# Altium schematic sheet fpga1.SchDoc: FPGA First Part
size A2; Organization: Berne University of Applied Science; Address1: School of Engineering and; Address2: Information Technology; Address3: Quellgasse 21; Address4: CH-2501 Biel; Revision: 1.0; SheetNumber: 3; SheetTotal: 19; ApprovedBy: zem1; Author: zac1; PageSetup: Record=PageOptions|CenterHorizontal=True|CenterVertical=True|PrintScale=0.71|XCorrection=1.00|YCorrection=1.00|PrintKind=0|BorderSize=5000000|LeftOffset=0|BottomOffset=0|Orientation=2|PaperLength=1000|PaperWidth=1000|Scale=100|PaperSource=15|PrintQuality=4000|MediaType=1|DitherType=0|PaperKind=A3|PrintScaleMode=1
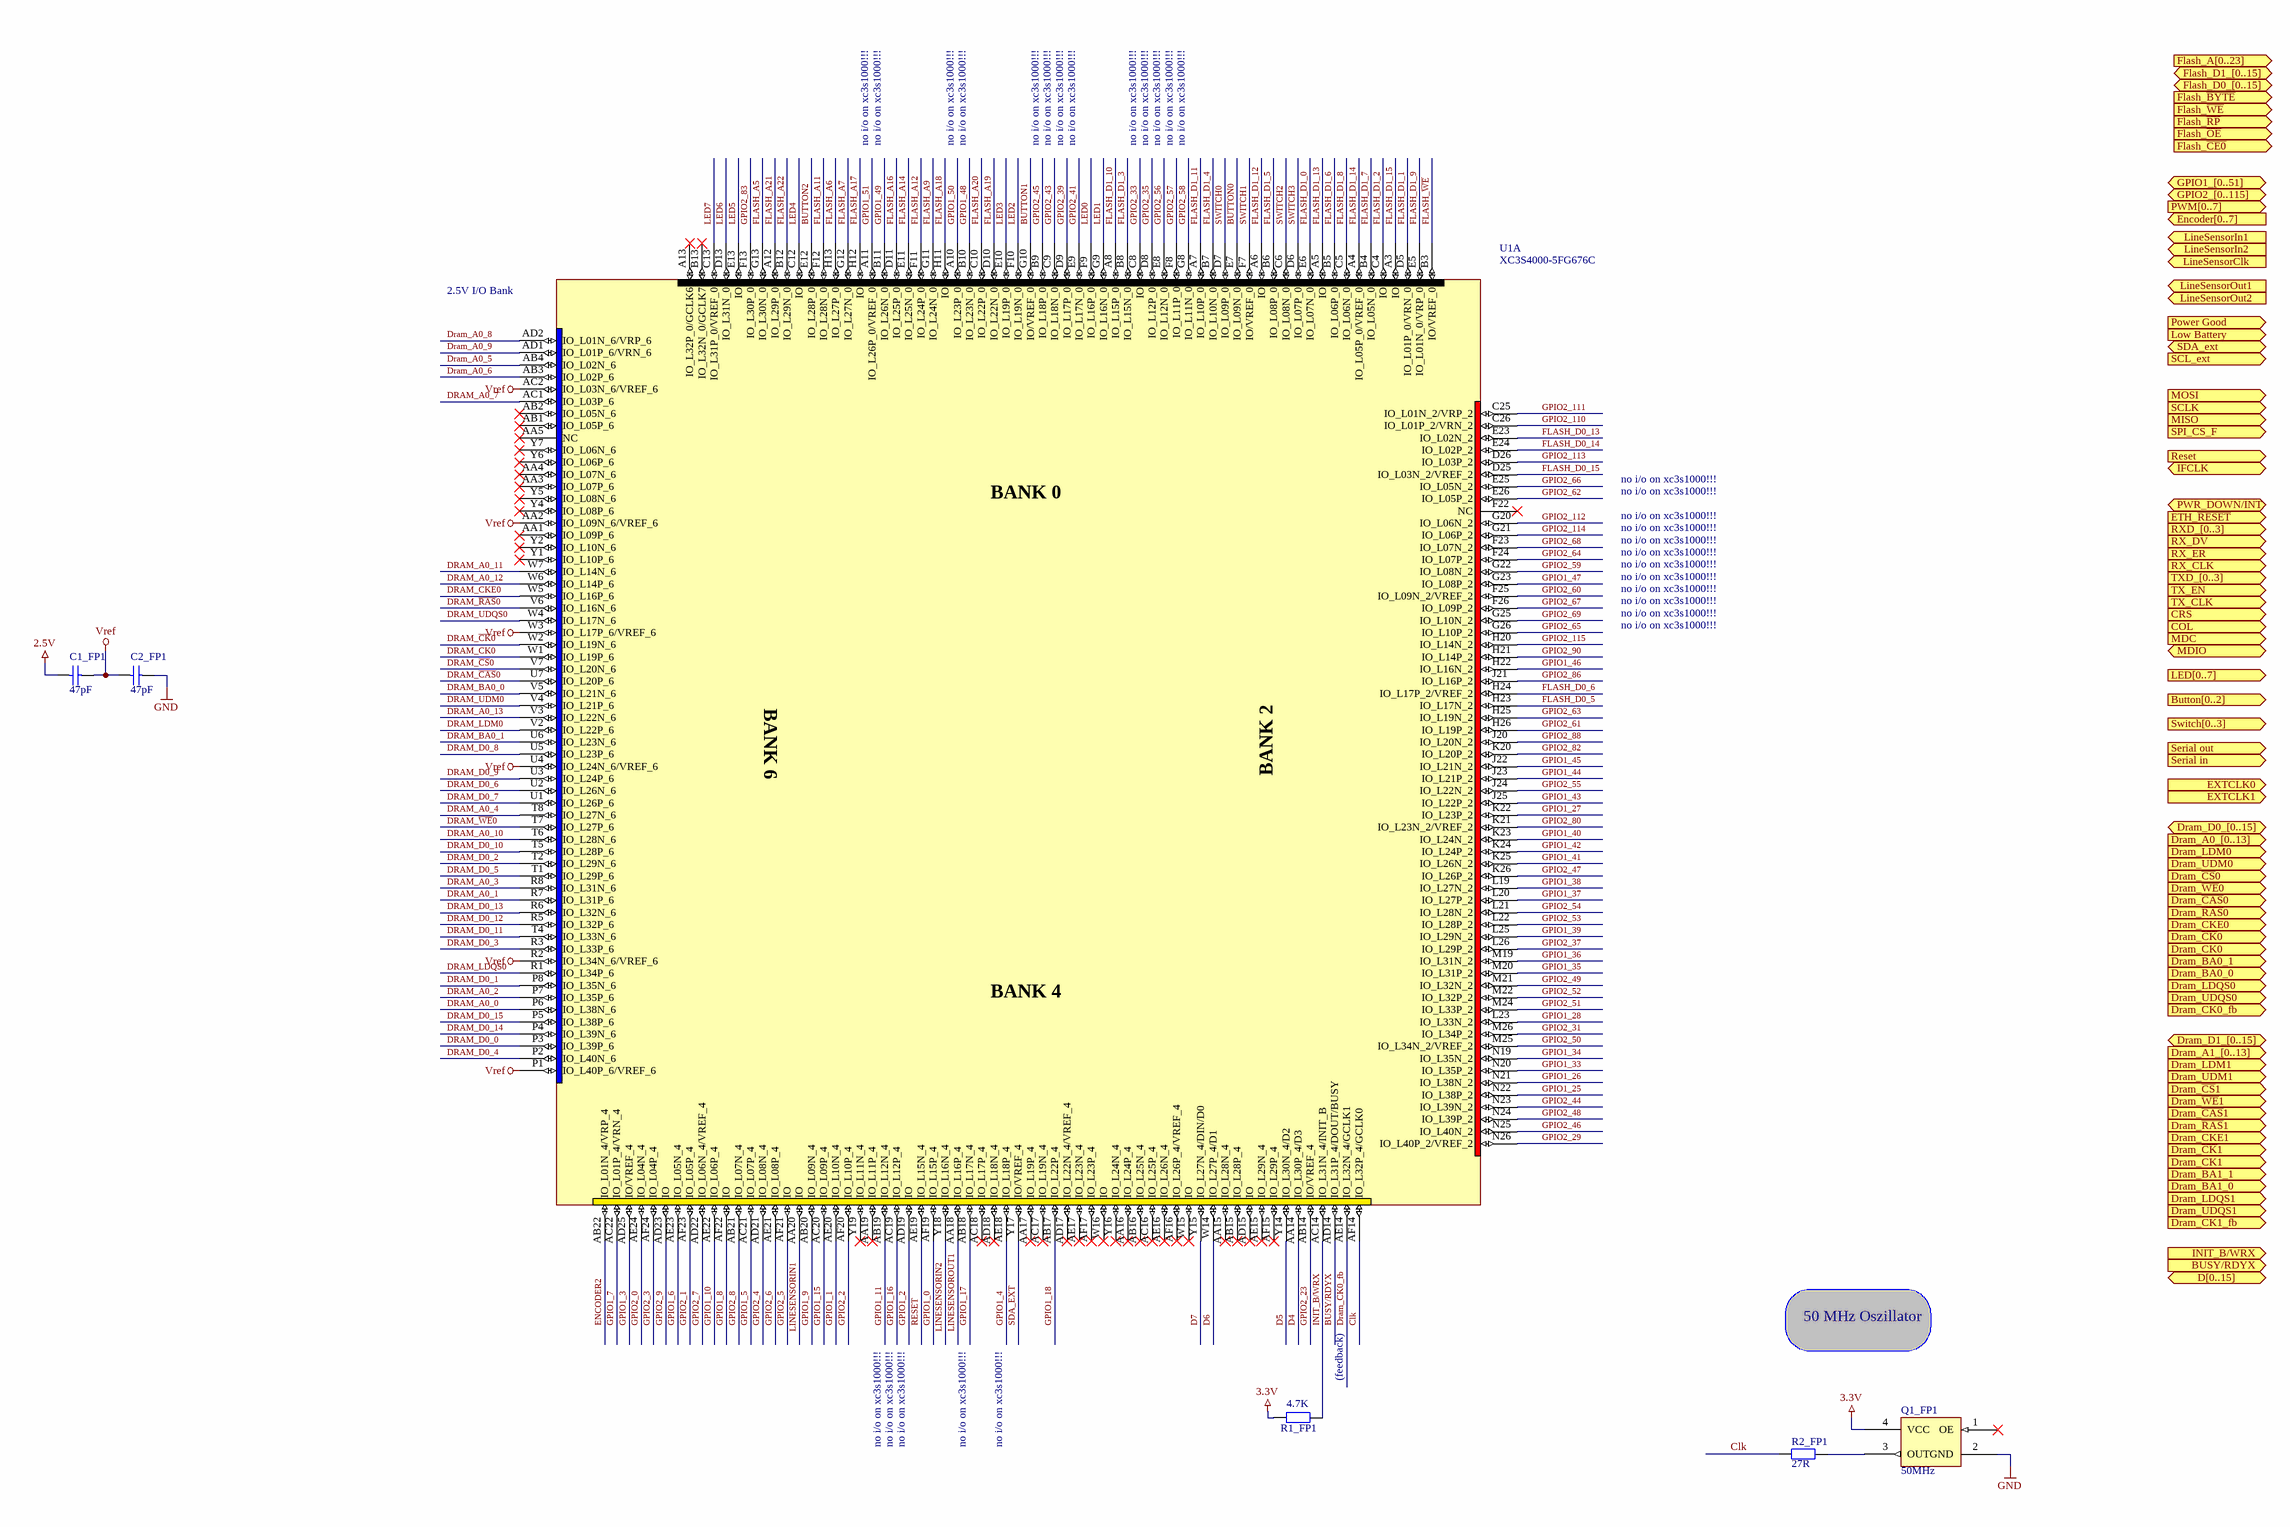
[diagram p0: fpga1.SchDoc]

## Parts
C1_FP1  value 47pF  [0402]  (hidden comment: Cap)
C2_FP1  value 47pF  [0402]  (hidden comment: Cap)
Q1_FP1  50MHz  [SMD-VX3E]
R1_FP1  value 4.7K  [0402]  (hidden comment: Res2)
R2_FP1  value 27R  [0402]  (hidden comment: Res2)
U1  XC3S4000-5FG676C  [FG676]  (part A of 3)

## Ports
BUSY/RDYX (out), Button[0..2] (in), COL (in), CRS (in), D[0..15] (bidir), Dram_A0_[0..13] (out), Dram_A1_[0..13] (out), Dram_BA0_0 (out), Dram_BA0_1 (out), Dram_BA1_0 (out), Dram_BA1_1 (out), Dram_CK0 (out), Dram_CK0_fb (in), Dram_CK1 (out), Dram_CK1_fb (in), Dram_CKE0 (out), Dram_CKE1 (out), Dram_D0_[0..15] (bidir), Dram_D1_[0..15] (bidir), Dram_LDM0 (out), Dram_LDM1 (out), Dram_LDQS0 (out), Dram_LDQS1 (out), Dram_UDM0 (out), Dram_UDM1 (out), Dram_UDQS0 (out), Dram_UDQS1 (out), Dram_~{CAS}0 (out), Dram_~{CAS}1 (out), Dram_~{CK}0 (out), Dram_~{CK}1 (out), Dram_~{CS}0 (out), Dram_~{CS}1 (out), Dram_~{RAS}0 (out), Dram_~{RAS}1 (out), Dram_~{WE}0 (out), Dram_~{WE}1 (out), Encoder[0..7] (in), ETH_~{RESET} (out), EXTCLK0 (in), EXTCLK1 (in), Flash_A[0..23] (out), Flash_D0_[0..15] (bidir), Flash_D1_[0..15] (bidir), Flash_~{BYTE} (out), Flash_~{CE0} (out), Flash_~{OE} (out), Flash_~{RP} (out), Flash_~{WE} (out), GPIO1_[0..51] (bidir), GPIO2_[0..115] (bidir), IFCLK (bidir), INIT_B/WRX (out), LED[0..7] (out), LineSensorClk (out), LineSensorIn1 (out), LineSensorIn2 (out), LineSensorOut1 (in), LineSensorOut2 (in), Low Battery (in), MDC (out), MDIO (bidir), MISO (in), MOSI (in), Power Good (in), PWM[0..7] (out), PWR_DOWN/INT (bidir), Reset (in), RX_CLK (in), RX_DV (in), RX_ER (in), RXD_[0..3] (in), SCL_ext (out), SCLK (in), SDA_ext (bidir), Serial in (in), Serial out (out), SPI_CS_F (in), Switch[0..3] (in), TX_CLK (in), TX_EN (out), TXD_[0..3] (out)

## Nets
2.5V: C1_FP1.2
3.3V: Q1_FP1.4(VCC) R1_FP1.1
GND: C2_FP1.1 Q1_FP1.2(GND)
Vref: C1_FP1.1 C2_FP1.2 U1.AA2(IO_L09N_6/VREF_6) U1.AC2(IO_L03N_6/VREF_6) U1.P1(IO_L40P_6/VREF_6) U1.R2(IO_L34N_6/VREF_6) U1.U4(IO_L24N_6/VREF_6) U1.W3(IO_L17P_6/VREF_6)
BUSY/RDYX: U1.AD14(IO_L31P_4/DOUT/BUSY)
BUTTON0: U1.E7(IO_L09N_0)
BUTTON1: U1.G10(IO/VREF_0)
BUTTON2: U1.E12(IO_L28P_0)
Clk: R2_FP1.1 U1.AF14(IO_L32P_4/GCLK0)
D4: U1.AA14(IO_L30P_4/D3)
D5: U1.Y14(IO_L30N_4/D2)
D6: U1.W14(IO_L27P_4/D1)
D7: U1.Y15(IO_L27N_4/DIN/D0)
DRAM_A0_0: U1.P6(IO_L38N_6)
DRAM_A0_1: U1.R7(IO_L31P_6)
DRAM_A0_2: U1.P7(IO_L35P_6)
DRAM_A0_3: U1.R8(IO_L31N_6)
DRAM_A0_4: U1.T8(IO_L27N_6)
Dram_A0_5: U1.AB4(IO_L02N_6)
Dram_A0_6: U1.AB3(IO_L02P_6)
DRAM_A0_7: U1.AC1(IO_L03P_6)
Dram_A0_8: U1.AD2(IO_L01N_6/VRP_6)
Dram_A0_9: U1.AD1(IO_L01P_6/VRN_6)
DRAM_A0_10: U1.T6(IO_L28N_6)
DRAM_A0_11: U1.W7(IO_L14N_6)
DRAM_A0_12: U1.W6(IO_L14P_6)
DRAM_A0_13: U1.V3(IO_L22N_6)
DRAM_BA0_0: U1.V5(IO_L21N_6)
DRAM_BA0_1: U1.U6(IO_L23N_6)
DRAM_~{CAS}0: U1.U7(IO_L20P_6)
DRAM_~{CK}0: U1.W2(IO_L19N_6)
DRAM_~{CS}0: U1.V7(IO_L20N_6)
DRAM_CK0: U1.W1(IO_L19P_6)
Dram_CK0_fb: U1.AE14(IO_L32N_4/GCLK1)
DRAM_CKE0: U1.W5(IO_L16P_6)
DRAM_D0_0: U1.P3(IO_L39P_6)
DRAM_D0_1: U1.P8(IO_L35N_6)
DRAM_D0_2: U1.T2(IO_L29N_6)
DRAM_D0_3: U1.R3(IO_L33P_6)
DRAM_D0_4: U1.P2(IO_L40N_6)
DRAM_D0_5: U1.T1(IO_L29P_6)
DRAM_D0_6: U1.U2(IO_L26N_6)
DRAM_D0_7: U1.U1(IO_L26P_6)
DRAM_D0_8: U1.U5(IO_L23P_6)
DRAM_D0_9: U1.U3(IO_L24P_6)
DRAM_D0_10: U1.T5(IO_L28P_6)
DRAM_D0_11: U1.T4(IO_L33N_6)
DRAM_D0_12: U1.R5(IO_L32P_6)
DRAM_D0_13: U1.R6(IO_L32N_6)
DRAM_D0_14: U1.P4(IO_L39N_6)
DRAM_D0_15: U1.P5(IO_L38P_6)
DRAM_LDM0: U1.V2(IO_L22P_6)
DRAM_LDQS0: U1.R1(IO_L34P_6)
DRAM_~{RAS}0: U1.V6(IO_L16N_6)
DRAM_UDM0: U1.V4(IO_L21P_6)
DRAM_UDQS0: U1.W4(IO_L17N_6)
DRAM_~{WE}0: U1.T7(IO_L27P_6)
ENCODER2: U1.AB22(IO_L01N_4/VRP_4)
FLASH_A5: U1.G13(IO_L30N_0)
FLASH_A6: U1.H13(IO_L27P_0)
FLASH_A7: U1.G12(IO_L27N_0)
FLASH_A9: U1.G11(IO_L24N_0)
FLASH_A11: U1.F12(IO_L28N_0)
FLASH_A12: U1.F11(IO_L24P_0)
FLASH_A14: U1.E11(IO_L25N_0)
FLASH_A16: U1.D11(IO_L25P_0)
FLASH_A17: U1.H12(IO)
FLASH_A18: U1.H11(IO)
FLASH_A19: U1.D10(IO_L22N_0)
FLASH_A20: U1.C10(IO_L22P_0)
FLASH_A21: U1.A12(IO_L29P_0)
FLASH_A22: U1.B12(IO_L29N_0)
FLASH_D0_5: U1.H23(IO_L17N_2)
FLASH_D0_6: U1.H24(IO_L17P_2/VREF_2)
FLASH_D0_13: U1.E23(IO_L02N_2)
FLASH_D0_14: U1.E24(IO_L02P_2)
FLASH_D0_15: U1.D25(IO_L03N_2/VREF_2)
FLASH_D1_0: U1.E6(IO_L07N_0)
FLASH_D1_1: U1.D5(IO_L01P_0/VRN_0)
FLASH_D1_2: U1.C4(IO)
FLASH_D1_3: U1.B8(IO_L15N_0)
FLASH_D1_4: U1.B7(IO_L10N_0)
FLASH_D1_5: U1.B6(IO_L08P_0)
FLASH_D1_6: U1.B5(IO_L06P_0)
FLASH_D1_7: U1.B4(IO_L05N_0)
FLASH_D1_8: U1.C5(IO_L06N_0)
FLASH_D1_9: U1.E5(IO_L01N_0/VRP_0)
FLASH_D1_10: U1.A8(IO_L15P_0)
FLASH_D1_11: U1.A7(IO_L10P_0)
FLASH_D1_12: U1.A6(IO)
FLASH_D1_13: U1.A5(IO)
FLASH_D1_14: U1.A4(IO_L05P_0/VREF_0)
FLASH_D1_15: U1.A3(IO)
FLASH_~{WE}: U1.B3(IO/VREF_0)
GPIO1_0: U1.AF19(IO_L15P_4)
GPIO1_1: U1.AE20(IO_L10N_4)
GPIO1_2: U1.AD19(IO)
GPIO1_3: U1.AD25(IO/VREF_4)
GPIO1_4: U1.AE18(IO_L18P_4)
GPIO1_5: U1.AC21(IO_L07P_4)
GPIO1_6: U1.AE23(IO_L05N_4)
GPIO1_7: U1.AC22(IO_L01P_4/VRN_4)
GPIO1_8: U1.AF22(IO)
GPIO1_9: U1.AB20(IO_L09N_4)
GPIO1_10: U1.AE22(IO_L06P_4)
GPIO1_11: U1.AB19(IO_L12N_4)
GPIO1_15: U1.AC20(IO_L09P_4)
GPIO1_16: U1.AC19(IO_L12P_4)
GPIO1_17: U1.AB18(IO_L17N_4)
GPIO1_18: U1.AB17(IO_L22P_4)
GPIO1_25: U1.N22(IO_L38P_2)
GPIO1_26: U1.N21(IO_L38N_2)
GPIO1_27: U1.K22(IO_L23P_2)
GPIO1_28: U1.L23(IO_L33N_2)
GPIO1_33: U1.N20(IO_L35P_2)
GPIO1_34: U1.N19(IO_L35N_2)
GPIO1_35: U1.M20(IO_L31P_2)
GPIO1_36: U1.M19(IO_L31N_2)
GPIO1_37: U1.L20(IO_L27P_2)
GPIO1_38: U1.L19(IO_L27N_2)
GPIO1_39: U1.L25(IO_L29N_2)
GPIO1_40: U1.K23(IO_L24N_2)
GPIO1_41: U1.K25(IO_L26N_2)
GPIO1_42: U1.K24(IO_L24P_2)
GPIO1_43: U1.J25(IO_L22P_2)
GPIO1_44: U1.J23(IO_L21P_2)
GPIO1_45: U1.J22(IO_L21N_2)
GPIO1_46: U1.H22(IO_L16N_2)
GPIO1_47: U1.G23(IO_L08P_2)
GPIO1_48: U1.B10(IO_L23N_0)
GPIO1_49: U1.B11(IO_L26N_0)
GPIO1_50: U1.A10(IO_L23P_0)
GPIO1_51: U1.A11(IO_L26P_0/VREF_0)
GPIO2_0: U1.AE24(IO_L04N_4)
GPIO2_1: U1.AF23(IO_L05P_4)
GPIO2_2: U1.AF20(IO_L10P_4)
GPIO2_3: U1.AF24(IO_L04P_4)
GPIO2_4: U1.AD21(IO_L08N_4)
GPIO2_5: U1.AF21(IO)
GPIO2_6: U1.AE21(IO_L08P_4)
GPIO2_7: U1.AD22(IO_L06N_4/VREF_4)
GPIO2_8: U1.AB21(IO_L07N_4)
GPIO2_9: U1.AD23(IO)
GPIO2_23: U1.AB14(IO/VREF_4)
GPIO2_29: U1.N26(IO_L40P_2/VREF_2)
GPIO2_31: U1.M26(IO_L34P_2)
GPIO2_33: U1.C8(IO)
GPIO2_35: U1.D8(IO_L12P_0)
GPIO2_37: U1.L26(IO_L29P_2)
GPIO2_39: U1.D9(IO_L17P_0)
GPIO2_41: U1.E9(IO_L17N_0)
GPIO2_43: U1.C9(IO_L18N_0)
GPIO2_44: U1.N23(IO_L39N_2)
GPIO2_45: U1.B9(IO_L18P_0)
GPIO2_46: U1.N25(IO_L40N_2)
GPIO2_47: U1.K26(IO_L26P_2)
GPIO2_48: U1.N24(IO_L39P_2)
GPIO2_49: U1.M21(IO_L32N_2)
GPIO2_50: U1.M25(IO_L34N_2/VREF_2)
GPIO2_51: U1.M24(IO_L33P_2)
GPIO2_52: U1.M22(IO_L32P_2)
GPIO2_53: U1.L22(IO_L28P_2)
GPIO2_54: U1.L21(IO_L28N_2)
GPIO2_55: U1.J24(IO_L22N_2)
GPIO2_56: U1.E8(IO_L12N_0)
GPIO2_57: U1.F8(IO_L11P_0)
GPIO2_58: U1.G8(IO_L11N_0)
GPIO2_59: U1.G22(IO_L08N_2)
GPIO2_60: U1.F25(IO_L09N_2/VREF_2)
GPIO2_61: U1.H26(IO_L19P_2)
GPIO2_62: U1.E26(IO_L05P_2)
GPIO2_63: U1.H25(IO_L19N_2)
GPIO2_64: U1.F24(IO_L07P_2)
GPIO2_65: U1.G26(IO_L10P_2)
GPIO2_66: U1.E25(IO_L05N_2)
GPIO2_67: U1.F26(IO_L09P_2)
GPIO2_68: U1.F23(IO_L07N_2)
GPIO2_69: U1.G25(IO_L10N_2)
GPIO2_80: U1.K21(IO_L23N_2/VREF_2)
GPIO2_82: U1.K20(IO_L20P_2)
GPIO2_83: U1.F13(IO_L30P_0)
GPIO2_86: U1.J21(IO_L16P_2)
GPIO2_88: U1.J20(IO_L20N_2)
GPIO2_90: U1.H21(IO_L14P_2)
GPIO2_110: U1.C26(IO_L01P_2/VRN_2)
GPIO2_111: U1.C25(IO_L01N_2/VRP_2)
GPIO2_112: U1.G20(IO_L06N_2)
GPIO2_113: U1.D26(IO_L03P_2)
GPIO2_114: U1.G21(IO_L06P_2)
GPIO2_115: U1.H20(IO_L14N_2)
INIT_B/WRX: R1_FP1.2 U1.AC14(IO_L31N_4/INIT_B)
LED0: U1.F9(IO_L16P_0)
LED1: U1.G9(IO_L16N_0)
LED2: U1.F10(IO_L19N_0)
LED3: U1.E10(IO_L19P_0)
LED4: U1.C12(IO)
LED5: U1.E13(IO)
LED6: U1.D13(IO_L31N_0)
LED7: U1.C13(IO_L31P_0/VREF_0)
LINESENSORIN1: U1.AA20(IO)
LINESENSORIN2: U1.Y18(IO_L16N_4)
LINESENSOROUT1: U1.AA18(IO_L16P_4)
RESET: U1.AE19(IO_L15N_4)
SDA_EXT: U1.Y17(IO/VREF_4)
SWITCH0: U1.D7(IO_L09P_0)
SWITCH1: U1.F7(IO/VREF_0)
SWITCH2: U1.C6(IO_L08N_0)
SWITCH3: U1.D6(IO_L07P_0)
NetQ1_FP1_3: Q1_FP1.3(OUT) R2_FP1.2

Not connected (* = marked no-connect by the designer): Q1_FP1 1(OE)*; U1 A13(IO_L32P_0/GCLK6)* AA1(IO_L09P_6)* AA3(IO_L07P_6)* AA4(IO_L07N_6)* AA5(NC)* AA15(IO_L28N_4)* AA16(IO_L24P_4)* AA17(IO_L19P_4)* AA19(IO_L11P_4)* AB1(IO_L05P_6)* AB2(IO_L05N_6)* AB15(IO_L28P_4)* AB16(IO_L25N_4)* AC16(IO_L25P_4)* AC17(IO_L19N_4)* AC18(IO_L17P_4)* AD15(IO)* AD17(IO_L22N_4/VREF_4)* AD18(IO_L18N_4)* AE15(IO_L29N_4)* AE16(IO_L26N_4)* AE17(IO_L23N_4)* AF15(IO_L29P_4)* AF16(IO_L26P_4/VREF_4)* AF17(IO_L23P_4)* B13(IO_L32N_0/GCLK7)* F22(NC)* W15(IO)* W16(IO)* Y1(IO_L10P_6)* Y2(IO_L10N_6)* Y4(IO_L08P_6)* Y5(IO_L08N_6)* Y6(IO_L06P_6)* Y7(IO_L06N_6)* Y16(IO_L24N_4)* Y19(IO_L11N_4)*

## Notes on the sheet
- no i/o on xc3s1000!!!
- (near U1) 2.5V I/O Bank
- (near R1_FP1) (feedback)
- 50 MHz Oszillator
- Title:
- Size:
- Date:
- File:
- A2_L
- Author:
- Time:
- Revision:
- Sheet
- of
- (in symbol XC3S1500-5FG676C, part A) BANK 0; BANK 6; BANK 2; BANK 4

## Library data of the parts
C1_FP1 C2_FP1 = Cap: Capacitor; Manufacturer: Murata; Part Number: GRM1555C1H470JZ01D; Class I: Passive; Currency: CHF; Packaging unit: 10; Prize: 0.07; Published: 8-Jun-2000; Revision: July-2002: Re-released for DXP Platform.; Publisher: Altium Limited; Class II: Capacitor; Distributor Number: 8819 670; RoHS: yes; Distributor: Farnell
Q1_FP1 = QUARZ_OSZI_SMD: TTL Quarz Oszillator; Manufacturer: Jauch; Part Number: VX3MH-5000; Value: 50MHz-osc; Currency: CHF; Packaging unit: 1; Prize: 6.99; Distributor Number: 644127; RoHS: yes; Distributor: Distrelec
R1_FP1 = Res2: Resistor; Manufacturer: PHYCOMP; Part Number: 232270674702; Class I: Passive; Currency: CHF; Packaging unit: 50; Prize: 0.12; Published: 8-Jun-2000; Revision: July-2002: Re-released for DXP Platform.; Publisher: Altium Limited; Class II: Resistor; Distributor Number: 9239316; RoHS: yes; Distributor: Farnell
R2_FP1 = Res2: Resistor; Manufacturer: PHYCOMP; Part Number: 232270672709; Class I: Passive; Currency: CHF; Packaging unit: 50; Prize: 0.12; Published: 8-Jun-2000; Revision: July-2002: Re-released for DXP Platform.; Publisher: Altium Limited; Class II: Resistor; Distributor Number: 9239049; RoHS: yes; Distributor: Farnell
U1 = XC3S1500-5FG676C: Spartan-3 1.2V FPGA, 487 User I/Os, 676-ball FBGA, High Performance, Commercial Grade; Manufacturer: Xilinx; PackageDocument: ver1.1, Apr-2001; Currency: CHF; lead time: 6 Weeks; Packaging unit: 40; Prize: 184.72; Published: 17-Sep-2003; LatestRevisionDate: 6-Jun-2005; LatestRevisionNote: Bubble removed from PROG_B pin.; DatasheetDocument: 04-Mar-2004; PackageReference: FG676; Publisher: Altium Limited; Code_JEDEC: MS-034-AAL-1; Code_IPC: PBGA 27X27 FE676; ComponentLink1Description: Manufacturer Link; ComponentLink1URL: http://www.xilinx.com/xlnx/xil_prodcat_landingpage.jsp?title=Spartan-3; ComponentLink2Description: Datasheet; ComponentLink2URL: http://direct.xilinx.com/bvdocs/publications/ds099.pdf; Value: XC3S4000-5FG676C; Distributor Number: XC3S40005FGG676C; Part Number: XC3S4000-5FG676C; RoHS: yes; Distributor: Silica